# EAGLE design oresat-camera-board-v2 (EAGLE 9.3.2)
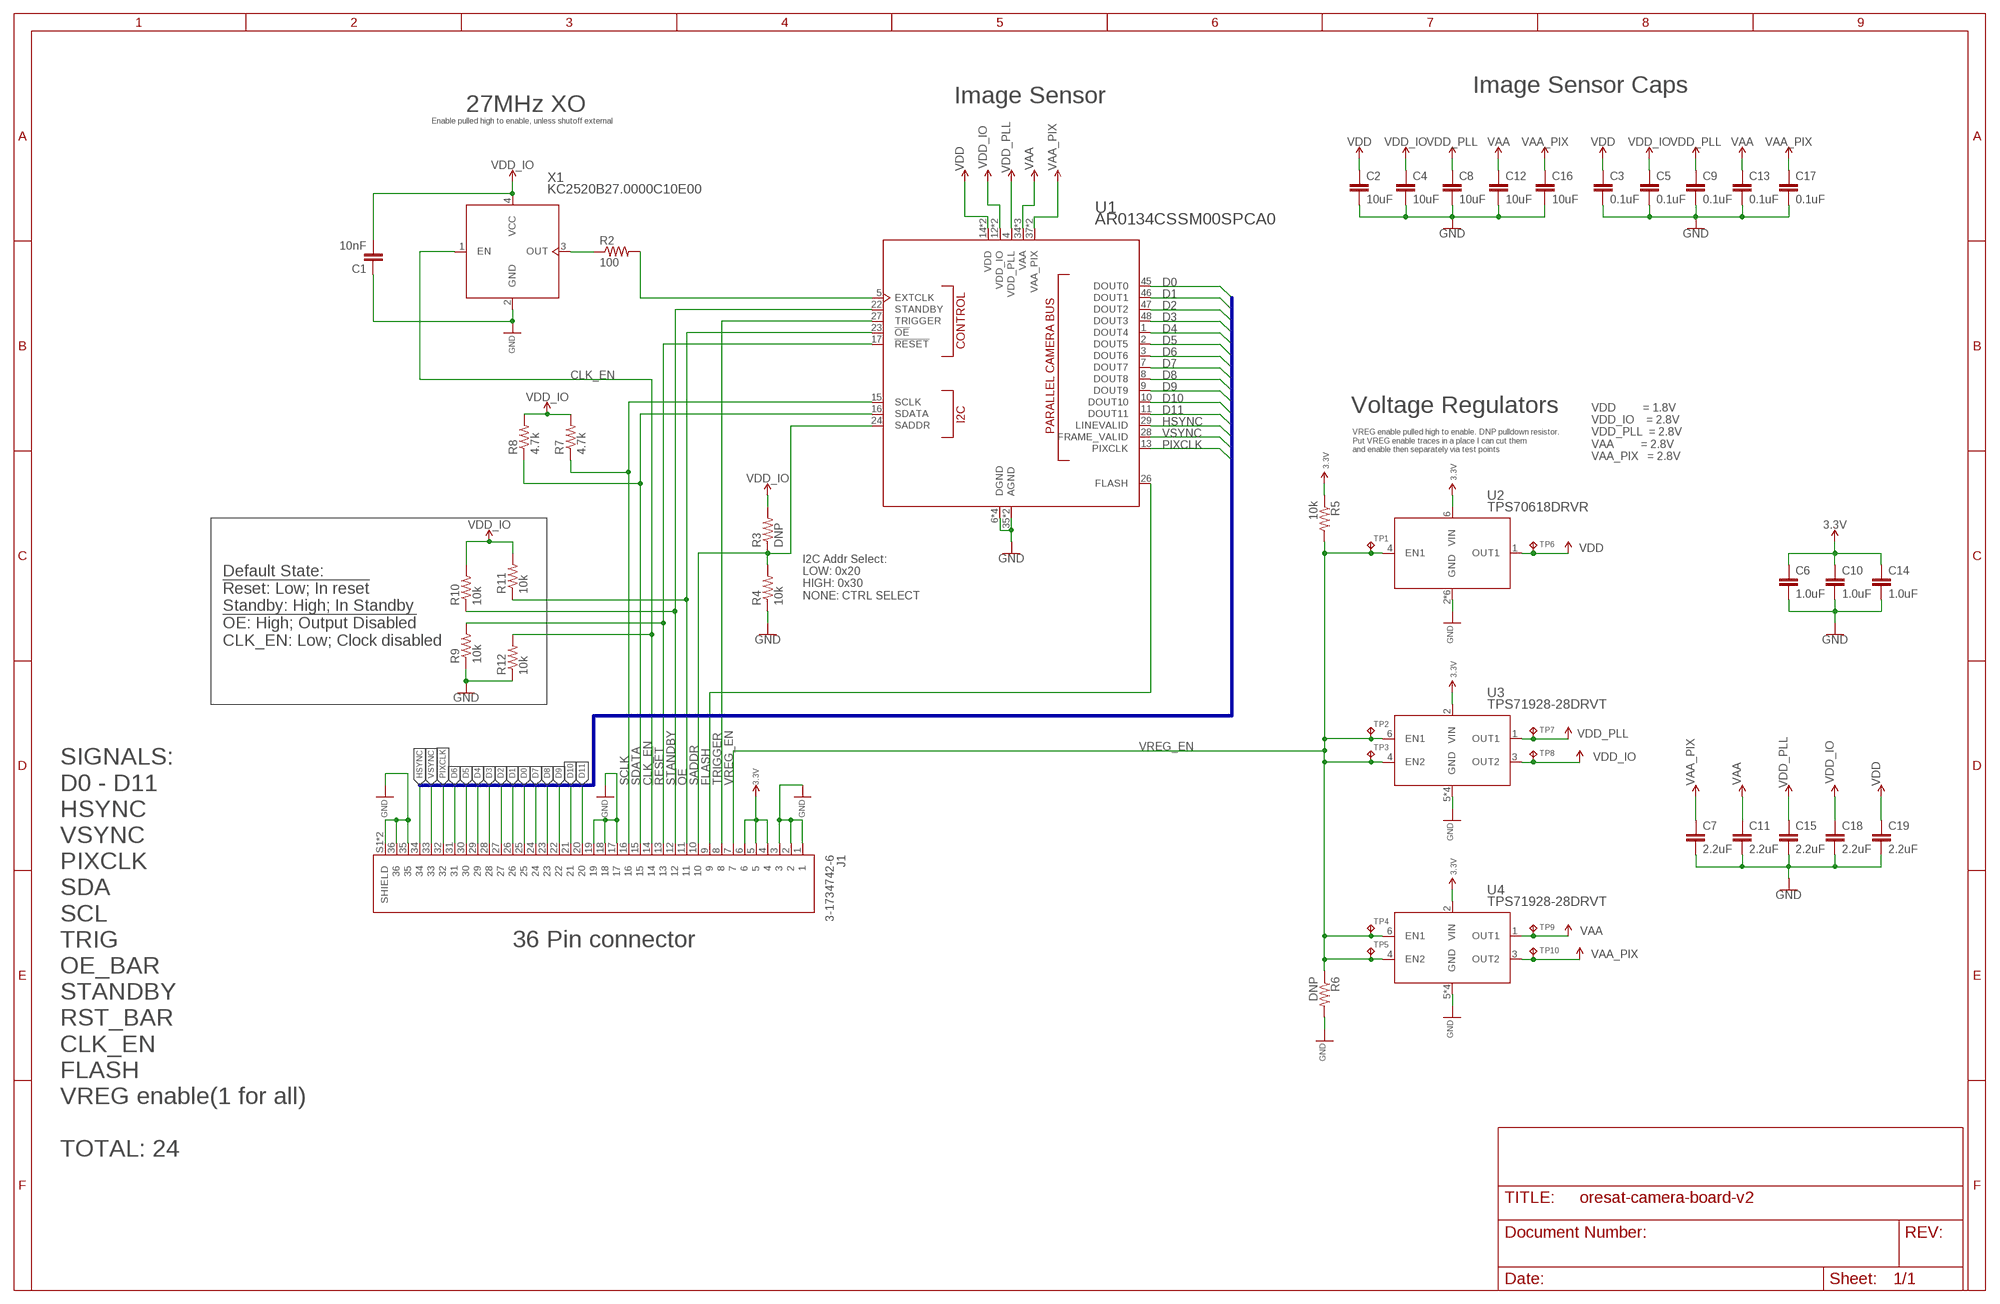
[diagram p0: schematic, sheet 1]

## Parts
C1  10nF  C-EU0402-A-NOSILK  [.0402-A-NOSILK]
C2  10uF  C-EU0603-C-NOSILK  [.0603-C-NOSILK]
C3  0.1uF  C-EU0402-B-NOSILK  [.0402-B-NOSILK]
C4  10uF  C-EU0603-C-NOSILK  [.0603-C-NOSILK]
C5  0.1uF  C-EU0402-B-NOSILK  [.0402-B-NOSILK]
C6  1.0uF  C-EU0603-C-NOSILK  [.0603-C-NOSILK]
C7  2.2uF  C-EU0603-C-NOSILK  [.0603-C-NOSILK]
C8  10uF  C-EU0603-C-NOSILK  [.0603-C-NOSILK]
C9  0.1uF  C-EU0402-B-NOSILK  [.0402-B-NOSILK]
C10  1.0uF  C-EU0603-C-NOSILK  [.0603-C-NOSILK]
C11  2.2uF  C-EU0603-C-NOSILK  [.0603-C-NOSILK]
C12  10uF  C-EU0603-C-NOSILK  [.0603-C-NOSILK]
C13  0.1uF  C-EU0402-B-NOSILK  [.0402-B-NOSILK]
C14  1.0uF  C-EU0603-C-NOSILK  [.0603-C-NOSILK]
C15  2.2uF  C-EU0603-C-NOSILK  [.0603-C-NOSILK]
C16  10uF  C-EU0603-C-NOSILK  [.0603-C-NOSILK]
C17  0.1uF  C-EU0402-B-NOSILK  [.0402-B-NOSILK]
C18  2.2uF  C-EU0603-C-NOSILK  [.0603-C-NOSILK]
C19  2.2uF  C-EU0603-C-NOSILK  [.0603-C-NOSILK]
J1  3-1734742-6  [TE_3-1734742-6]
R2  100  R-US_0402-B  [.0402-B]
R3  DNP  R-US_0402-B-NOSILK  [.0402-B-NOSILK]
R4  10k  R-US_0402-B-NOSILK  [.0402-B-NOSILK]
R5  10k  R-US_0402-B-NOSILK  [.0402-B-NOSILK]
R6  DNP  R-US_0402-B-NOSILK  [.0402-B-NOSILK]
R7  4.7k  R-US_0402-B-NOSILK  [.0402-B-NOSILK]
R8  4.7k  R-US_0402-B-NOSILK  [.0402-B-NOSILK]
R9  10k  R-US_0402-B  [.0402-B]
R10  10k  R-US_0402-B  [.0402-B]
R11  10k  R-US_0402-B  [.0402-B]
R12  10k  R-US_0402-B  [.0402-B]
TP1  TPTP06R  [TP06R]
TP2  TPTP06R  [TP06R]
TP3  TPTP06R  [TP06R]
TP4  TPTP06R  [TP06R]
TP5  TPTP06R  [TP06R]
TP6  TPTP06R  [TP06R]
TP7  TPTP06R  [TP06R]
TP8  TPTP06R  [TP06R]
TP9  TPTP06R  [TP06R]
TP10  TPTP06R  [TP06R]
U1  AR0134CSSM00SPCA0  [AR0134CSSM00SPCA0]
U2  TPS70618DRVR  [DRV6_1P6X1]
U3  TPS71928-28DRVT  [DRV6_1P6X1]
U4  TPS71928-28DRVT  [DRV6_1P6X1]
X1  KC2520B27.0000C10E00  [OSC_KYOCERA_KC2520B]

## Nets
3.3V: C6.1 C10.1 C14.1 J1.4 J1.5 J1.6 R5.1 U2.6(VIN) U3.2(VIN) U4.2(VIN)
!OE: J1.11 R11.1 U1.23(!OE)
!RESET: J1.13 R9.2 U1.17(!RESET)
CLK_EN: J1.14 R12.2 X1.1(EN)
D0: J1.25 U1.45(DOUT0)
D1: J1.26 U1.46(DOUT1)
D2: J1.27 U1.47(DOUT2)
D3: J1.28 U1.48(DOUT3)
D4: J1.29 U1.1(DOUT4)
D5: J1.30 U1.2(DOUT5)
D6: J1.31 U1.3(DOUT6)
D7: J1.24 U1.7(DOUT7)
D8: J1.23 U1.8(DOUT8)
D9: J1.22 U1.9(DOUT9)
D10: J1.21 U1.10(DOUT10)
D11: J1.20 U1.11(DOUT11)
FLASH: J1.9 U1.26(FLASH)
GND: C1.1 C2.2 C3.2 C4.2 C5.2 C6.2 C7.2 C8.2 C9.2 C10.2 C11.2 C12.2 C13.2 C14.2 C15.2 C16.2 C17.2 C18.2 C19.2 J1.1 J1.2 J1.3 J1.17 J1.18 J1.19 J1.35 J1.36 J1.S1(SHIELD) J1.S2(SHIELD) R4.1 R6.2 R9.1 R12.1 U1.6(DGND) U1.25(DGND) U1.30(DGND) U1.35(AGND) U1.39(AGND) U1.44(DGND) U2.2(GND) U2.3(GND) U2.5(GND) U2.7(GND) U2.8(GND) U2.9(GND) U3.5(GND) U3.7(GND) U3.8(GND) U3.9(GND) U4.5(GND) U4.7(GND) U4.8(GND) U4.9(GND) X1.2(GND)
HSYNC: J1.34 U1.29(LINEVALID)
N$1: R2.1 X1.3(OUT)
N$2: R2.2 U1.5(EXTCLK)
PIXCLK: J1.32 U1.13(PIXCLK)
SADDR: J1.10 R3.1 R4.2 U1.24(SADDR)
SCLK: J1.16 R7.1 U1.15(SCLK)
SDATA: J1.15 R8.1 U1.16(SDATA)
STANDBY: J1.12 R10.1 U1.22(STANDBY)
TRIGGER: J1.8 U1.27(TRIGGER)
VAA: C11.1 C12.1 C13.1 TP9.TP U1.34(VAA) U1.36(VAA) U1.40(VAA) U4.1(OUT1)
VAA_PIX: C7.1 C16.1 C17.1 TP10.TP U1.37(VAA_PIX) U1.38(VAA_PIX) U4.3(OUT2)
VDD: C2.1 C3.1 C19.1 TP6.TP U1.14(VDD) U1.19(VDD) U2.1(OUT1)
VDD_IO: C1.2 C4.1 C5.1 C18.1 R3.2 R7.2 R8.2 R10.2 R11.2 TP8.TP U1.12(VDD_IO) U1.18(VDD_IO) U3.3(OUT2) X1.4(VCC)
VDD_PLL: C8.1 C9.1 C15.1 TP7.TP U1.4(VDD_PLL) U3.1(OUT1)
VREG_EN: J1.7 R5.2 R6.1 TP1.TP TP2.TP TP3.TP TP4.TP TP5.TP U2.4(EN1) U3.4(EN2) U3.6(EN1) U4.4(EN2) U4.6(EN1)
VSYNC: J1.33 U1.28(FRAME_VALID)

## Buses
D[0..11],HSYNC,PIXCLK,VSYNC

## Notes on the sheet
- Image Sensor Caps
- Image Sensor
- 27MHz XO
- Enable pulled high to enable, unless shutoff external
- Voltage Regulators
- VREG enable pulled high to enable. DNP pulldown resistor. 
  Put VREG enable traces in a place I can cut them
  and enable then separately via test points
- VDD         = 1.8V
  VDD_IO    = 2.8V
  VDD_PLL  = 2.8V
  VAA         = 2.8V
  VAA_PIX   = 2.8V
- I2C Addr Select:
  LOW: 0x20
  HIGH: 0x30 
  NONE: CTRL SELECT
- Default State:
  !Reset: Low; In reset
  Standby: High; In Standby
  !OE: High; Output Disabled
  CLK_EN: Low; Clock disabled
- 36 Pin connector
- SIGNALS:
  D0 - D11
  HSYNC
  VSYNC
  PIXCLK
  SDA
  SCL
  TRIG
  OE_BAR
  STANDBY
  RST_BAR
  CLK_EN
  FLASH
  VREG enable(1 for all)
  
  TOTAL: 24

## Library data of the parts
C1-C19 = oresat-rcl:C-EU: CAPACITOR, European symbol
J1 = J-TEConnectivity-3-1734742-6 :3-1734742-6: 36 Position FFC, FPC Connector Contacts, Vertical, 1 Sided 0.020" (0.50mm) Surface Mount; COMMENT: 4-1734742-0; DESCRIPTION: Conn FPC Connector SKT 36 POS 0.5mm Solder ST SMD T/R; DIGI-KEY_PART_NUMBER: A100242CT-ND; MF: TE Connectivity; MP: 4-1734742-0; PACKAGE: None
R2-R12 = oresat-rcl:R-US_: RESISTOR, American symbol
TP1-TP10 = J-TestPoint-Small:TP: Test pad
U1 = U-ONSemi-AR0134:AR0134CSSM00SPCA0
U2 = U-TI-TPS70618-VoltageReg:TPS70618DRVR; MANUFACTURER_PART_NUMBER: TPS7192828DRVT; VENDOR: Texas Instruments
U3 U4 = U-TI-TPS71928-28-VoltageReg:TPS71928-28DRVT; MANUFACTURER_PART_NUMBER: TPS7192828DRVT; VENDOR: Texas Instruments
X1 = X-KYOCERA-KC2520B27:KC2520B27.0000C10E00; MANUFACTURER_PART_NUMBER: KC2520B27.0000C10E00; VENDOR: Kyocera

## Board
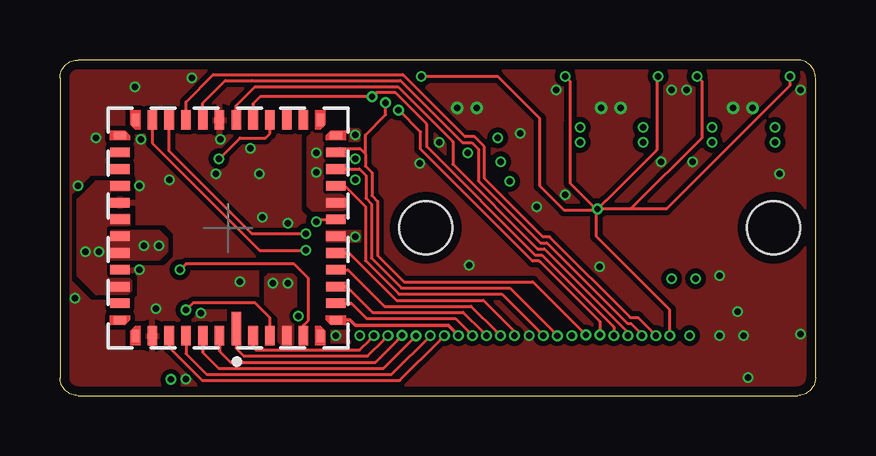
[diagram p1: board, top side]
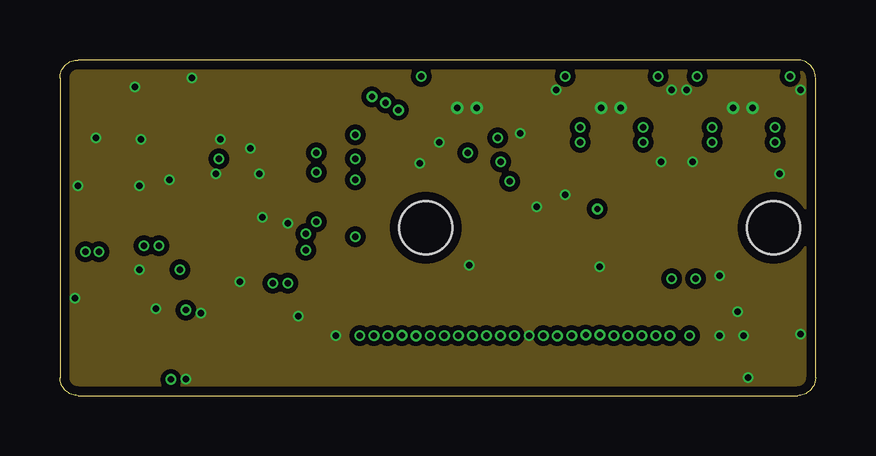
[diagram p2: board, inner layer Route2]
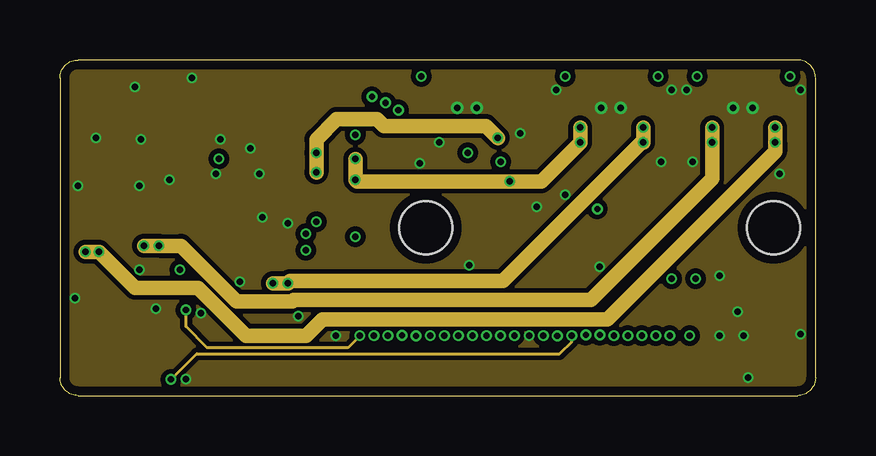
[diagram p3: board, inner layer Route15]
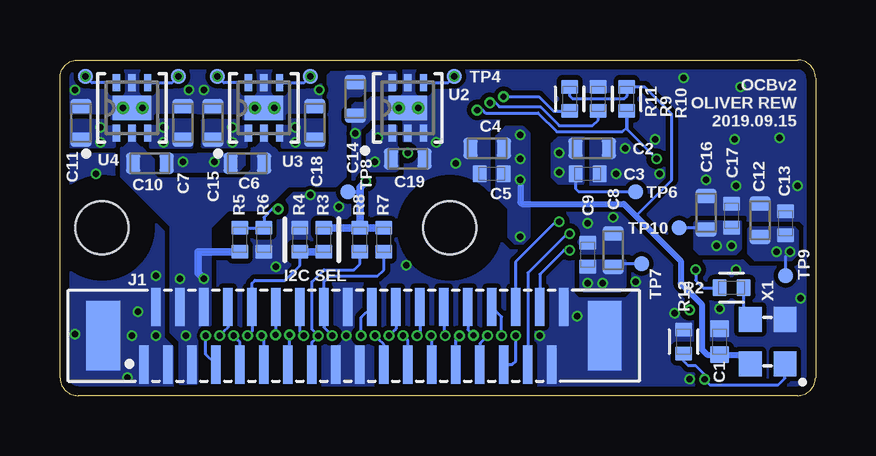
[diagram p4: board, bottom side, seen from below]

Size 31.5 x 14 mm. Coordinates in mm from the lower left corner, seen from the top.
Outline: 0.75,0 30.75,0 arc90 31.5,0.75 31.5,13.25 arc90 30.75,14 0.75,14 arc90 0,13.25 0,0.75 arc90 0.75,0
Copper layers (1*2*15*16): Top 0.035559375mm / dielectric 0.17018125mm / Route2 0.01778125mm / dielectric 47mil / Route15 0.01778125mm / dielectric 0.17018125mm / Bottom 0.035559375mm
Design rules "oshpark-4layer-tented": minimum track width 5mil, minimum drill 10mil, track to track 5mil, track to pad 5mil, pad to pad 5mil, via to via 5mil, smd to smd 5mil, copper to edge 15mil, drill to drill 6mil, minimum pad ring 4mil, minimum via ring 4mil, stop-mask expansion 2.5mil, vias tented up to drill 20mil, thermal gap 10mil
Holes 2.2 mm at 15.25,7 29.75,7
bRestrict: area 13.8,5.5 to 16.8,8.5; area 28.2,5.5 to 31.2,8.5

### Footprints (pad centres in the part's own frame; a part is rotated, then mirrored left to right if it is on the bottom)
.0402-A-NOSILK = smd 0.7 x 0.8: 1 -0.55,0; 2 0.55,0
.0603-C-NOSILK = smd 0.6 x 0.9: 1 -0.7,0; 2 0.7,0
.0402-B-NOSILK = smd 0.6 x 0.7: 1 -0.5,0; 2 0.5,0
TE_3-1734742-6 = smd 0.4 x 1.6: 1 -9.75,-1.2; 2 -9.25,1.2; 3 -8.75,-1.2; 4 -8.25,1.2; 5 -7.75,-1.2; 6 -7.25,1.2; 7 -6.75,-1.2; 8 -6.25,1.2; 9 -5.75,-1.2; 10 -5.25,1.2; 11 -4.75,-1.2; 12 -4.25,1.2; 13 -3.75,-1.2; 14 -3.25,1.2; 15 -2.75,-1.2; 16 -2.25,1.2; 17 -1.75,-1.2; 18 -1.25,1.2; 19 -0.75,-1.2; 20 -0.25,1.2; 21 0.25,-1.2; 22 0.75,1.2; 23 1.25,-1.2; 24 1.75,1.2; 25 2.25,-1.2; 26 2.75,1.2; 27 3.25,-1.2; 28 3.75,1.2; 29 4.25,-1.2; 30 4.75,1.2; 31 5.25,-1.2; 32 5.75,1.2; 33 6.25,-1.2; 34 6.75,1.2; 35 7.25,-1.2; 36 7.75,1.2 | smd 1.4 x 2.9: S1 -11.45,0; S2 9.45,0
.0402-B = smd 0.6 x 0.7: 1 -0.5,0; 2 0.5,0
TP06R = smd 0.6 x 0.6: TP 0,0
AR0134CSSM00SPCA0 = smd 0.4 x 1.4: 1 -0.35,4.2 | smd 0.4 x 0.8: 2 -1.05,4.5; 3 -1.75,4.5; 4 -2.45,4.5; 5 -3.15,4.5; 20 -3.15,-4.5; 21 -2.45,-4.5; 22 -1.75,-4.5; 23 -1.05,-4.5; 24 -0.35,-4.5; 25 0.35,-4.5; 26 1.05,-4.5; 27 1.75,-4.5; 28 2.45,-4.5; 29 3.15,-4.5; 44 3.15,4.5; 45 2.45,4.5; 46 1.75,4.5; 47 1.05,4.5; 48 0.35,4.5 | smd 0.3 x 0.5: 6 -3.85,4.5; 19 -3.85,-4.5; 30 3.85,-4.5; 43 3.85,4.5 | smd 0.5 x 0.3: 7 -4.5,3.85; 18 -4.5,-3.85; 31 4.5,-3.85; 42 4.5,3.85 | smd 0.8 x 0.4: 8 -4.5,3.15; 9 -4.5,2.45; 10 -4.5,1.75; 11 -4.5,1.05; 12 -4.5,0.35; 13 -4.5,-0.35; 14 -4.5,-1.05; 15 -4.5,-1.75; 16 -4.5,-2.45; 17 -4.5,-3.15; 32 4.5,-3.15; 33 4.5,-2.45; 34 4.5,-1.75; 35 4.5,-1.05; 36 4.5,-0.35; 37 4.5,0.35; 38 4.5,1.05; 39 4.5,1.75; 40 4.5,2.45; 41 4.5,3.15
DRV6_1P6X1 = smd 0.7 x 0.3: 1 -1.05,0.65; 2 -1.05,0; 3 -1.05,-0.65; 4 1.05,-0.65; 5 1.05,0; 6 1.05,0.65 | smd 1.016 x 1.6: 7 0,0 | drill 0.254 pad 0.508: 8 0,0.375; 9 0,-0.438
OSC_KYOCERA_KC2520B = smd 1.05 x 0.95: 1 -0.925,-0.725; 2 0.925,-0.725; 3 0.925,0.725; 4 -0.925,0.725

### Placement (x,y rotation side)
C1  4,2.25 270 bottom
C2  9.31,10.31 0 bottom
C3  9.5,9.25 0 bottom
C4  13.69,10.31 180 bottom
C5  13.5,9.25 180 bottom
C6  23.69,9.69 180 bottom
C7  26.38,11.38 90 bottom
C8  8.44,6.06 90 bottom
C9  9.5,5.88 90 bottom
C10  27.75,9.69 0 bottom
C11  30.62,11.38 90 bottom
C12  2.31,7.31 90 bottom
C13  1.25,7.19 90 bottom
C14  19.19,12.38 270 bottom
C15  25.12,11.38 90 bottom
C16  4.56,7.62 90 bottom
C17  3.5,7.5 90 bottom
C18  20.88,11.38 90 bottom
C19  17,9.88 0 bottom
J1  18.25,2.5 0 bottom
R2  3.5,4.5 180 bottom
R3  20.5,6.5 90 bottom
R4  21.5,6.5 270 bottom
R5  24,6.5 90 bottom
R6  23,6.5 270 bottom
R7  18,6.5 90 bottom
R8  19,6.5 90 bottom
R9  9.06,12.38 270 bottom
R10  7.88,12.38 90 bottom
R11  10.25,12.38 90 bottom
R12  5.5,2.25 270 bottom
TP1  30.44,13.31 0 bottom
TP2  24.94,13.31 0 bottom
TP3  26.56,13.31 0 bottom
TP4  15.06,13.31 0 bottom
TP5  21.06,13.31 0 bottom
TP6  7.5,8.5 0 bottom
TP7  7.25,5.5 0 bottom
TP8  19.5,8.5 0 bottom
TP9  1.25,5 0 bottom
TP10  5.69,7 0 bottom
U1  7,7 180 top
U2  17,12 90 bottom
U3  23,12 90 bottom
U4  28.5,12 90 bottom
X1  2,2.25 90 bottom

### Tracks (layer width: path | path; a pad name or v marks a point on that pad's centre or on a via)
3.3V  (via drill 0.25)
  Bottom 0.305: R5.1 25.75,6 25.75,5.12 v25.5,4.88
  other vias: 26.25,2.5 26.5,4.88
  pour Bottom (rank 2, no thermals): 28.94,10.31 28.94,9.31 28.06,9.31 28.06,10.31 28.12,10.31 28.38,10.56 28.38,11.25 28.62,11.25 28.62,10.56 28.88,10.31
  pour Bottom (rank 2, no thermals): 23.44,10.31 23.44,9.31 22.56,9.31 22.56,10.31 22.62,10.31 22.88,10.56 22.88,11.25 23.12,11.25 23.12,10.56 23.38,10.31
  pour Bottom (no thermals): 25.25,4.5 25.25,2.94 25.62,2.94 25.75,2.81 25.81,2.75 25.81,2.06 25.81,0.5 26.5,0.5 26.5,2.25 26.75,2.5 26.88,2.62 26.88,3.44 26.88,5.25 26.5,5.25 25.25,5.25
  pour Bottom (rank 3, no thermals): 26.88,5.25 26.88,7.06 28.94,9.12 28.94,10.31 28.06,10.31 27.62,9.88 27.62,9.25 27.44,9.06 23.88,9.06 23.5,9.44 23.5,10.31 22.56,10.31 22.44,10.19 20.44,10.19 20.31,10.31 20.31,13.38 20.19,13.5 18.81,13.5 18.69,13.38 18.69,12.81 19,12.5 19.44,12.5 19.62,12.31 19.62,9.12 20,8.75 22,8.75 23,7.75 24.5,7.75 25.25,7 25.25,5.25
  pour Bottom (no thermals): 17.69,12.75 19.62,12.75 19.69,12.81 19.69,13.38 19.56,13.5 17.56,13.5 17.5,13.44 17.5,12.81 17.56,12.75
!OE  (via drill 0.25)
  Top 0.127: v23.09,2.5 23.09,2.86 20.09,5.86 19.81,5.86 15.29,10.38 15.29,11.32 13.98,12.63 13.17,12.63 v13.01,12.46 8.34,12.46 8.05,12.18 U1.23
  Bottom 0.127: J1.11 23,2.41 v23.09,2.5 | v13.01,12.46 11.53,12.46 10.94,11.88 R11.1
!RESET  (via drill 0.25)
  Top 0.127: U1.17 11.66,10.31 12.5,10.31 12.73,10.08 | 12.73,10.08 12.73,9.56 13,9.29 13,8.34 13.24,8.1 13.24,5.84 14.34,4.74 19.71,4.74 21.75,2.7 21.75,2.69 v21.92,2.53 | 12.73,10.08 12.73,10.87 13.58,11.72 v13.58,12.21
  Bottom 0.127: J1.13 21.92,1.38 v21.92,2.53 | v13.58,12.21 13.35,12.21 13.18,12.04 11.47,12.04 10.68,11.26 9.3,11.26 9.06,11.5 R9.2
CLK_EN  (via drill 0.25)
  Route15 0.127: v4.62,0.67 5.7,1.75 20.83,1.75 21.34,2.25 v21.34,2.5
  Bottom 0.127: X1.1 1.27,0.72 1.56,0.45 4.4,0.45 v4.62,0.67 4.62,0.88 5,1.25 5.31,1.25 5.5,1.44 R12.2 | v21.34,2.5 21.5,2.67 J1.14
D0  (via drill 0.25)
  Top 0.127: U1.45 4.55,2.01 5.93,0.63 14.16,0.63 15.86,2.33 v16.02,2.5
  Bottom 0.127: J1.25 16,2.48 v16.02,2.5
D1  (via drill 0.25)
  Top 0.127: U1.46 5.25,1.75 6.12,0.88 13.82,0.88 v15.44,2.5
  Bottom 0.127: J1.26 15.5,2.56 v15.44,2.5
D2  (via drill 0.25)
  Top 0.127: U1.47 5.95,1.8 6.61,1.14 13.48,1.14 v14.84,2.5
  Bottom 0.127: J1.27 15,2.34 v14.84,2.5
D3  (via drill 0.25)
  Top 0.127: U1.48 6.65,1.85 7.11,1.39 13.15,1.39 14.09,2.33 14.09,2.34 v14.26,2.51
  Bottom 0.127: J1.28 14.5,2.75 v14.26,2.51
D4  (via drill 0.25)
  Top 0.127: U1.1 7.35,1.96 7.67,1.65 12.82,1.65 13.5,2.33 v13.67,2.5
  Bottom 0.127: v13.67,2.5 14,2.17 J1.29
D5  (via drill 0.25)
  Top 0.127: U1.2 8.05,2.01 8.16,1.9 12.49,1.9 12.92,2.33 v13.08,2.5
  Bottom 0.127: v13.08,2.5 13.08,3.28 J1.30
D6  (via drill 0.25)
  Top 0.127: U1.3 8.75,3.25 8.12,3.88 5.56,3.88 v5.25,3.57
  Route15 0.127: v12.5,2.5 12,2 6.13,2 5.25,2.88 v5.25,3.57
  Bottom 0.127: J1.31 12.64,1.3 12.5,1.44 v12.5,2.5
D7  (via drill 0.25)
  Top 0.152: U1.7 12.1,3.15 12.32,2.93 14.07,2.93 14.08,2.94 16.2,2.94 16.45,2.68 16.45,2.65 v16.61,2.5
  Bottom 0.127: J1.24 16.5,2.61 v16.61,2.5
D8  (via drill 0.25)
  Top 0.127: U1.8 12.15,3.85 12.78,3.22 16.48,3.22 17.02,2.67 v17.19,2.5
  Bottom 0.127: J1.23 17,2.3 17.02,2.33 v17.19,2.5
D9  (via drill 0.25)
  Top 0.127: U1.9 11.95,4.55 13.03,3.47 16.81,3.47 17.61,2.67 v17.77,2.5
  Bottom 0.127: J1.22 17.5,2.78 17.61,2.67 v17.77,2.5
D10  (via drill 0.25)
  Top 0.127: U1.10 12,5.25 13.53,3.72 17.14,3.72 18.19,2.67 v18.36,2.5
  Bottom 0.127: J1.21 18,2.13 18.19,2.33 v18.36,2.5
D11  (via drill 0.25)
  Top 0.127: U1.11 12.05,5.95 14.02,3.98 17.65,3.98 18.94,2.68 v18.94,2.5
  Bottom 0.127: v18.94,2.5 18.94,3.26 J1.20
FLASH  (via drill 0.25)
  Top 0.127: U1.26 5.95,12.2 6.89,13.14 8,13.14 14.19,13.14 16.78,10.54 17.17,10.54 17.44,10.28 17.44,8.95 20.02,6.37 20.3,6.37 23.67,3 23.81,3 24.26,2.56 v24.26,2.5
  Bottom 0.127: J1.9 24,2.24 24.09,2.33 v24.26,2.5
GND  (via drill 0.25)
  other vias: 3.38,10.69 11.5,2.5 4,3.62 3.31,5.25 1.5,10.75 3.31,8.75 6.69,10.69 4.56,9 8.44,7.44 9.5,7.19 8.31,9.25 7.94,10.31 0.75,8.75 15.81,10.56 19.19,10.94 20.69,12.75 25.5,12.75 26.12,12.75 30.88,12.75 26.38,9.75 25.06,9.75 0.62,4.06 19.56,2.5 15,9.69 19.88,7.88 21.06,8.38 27.5,2.5 28.25,3.5 27.5,5 28.5,2.5 30.88,2.56 28.69,0.75 22.5,5.38 7.5,4.75 9.94,3.31 17.06,5.44 6.5,9.25 5.5,13.25 3.12,12.88 30,9.25 5.88,3.44 5.25,0.69
  pour Top (isolate 0.2, rank 3): -0.25,-0.25 31.75,-0.25 31.75,14.25 -0.25,14.25
  pour Route2 (isolate 0.2): -1,-1 32.5,-1 32.5,15 -1,15
  pour Route15 (isolate 0.2, rank 3): -0.75,-0.75 32.25,-0.75 32.25,14.75 -0.75,14.75
  pour Bottom (isolate 0.2, rank 4, no thermals): -0.5,-0.5 32,-0.5 32,14.5 -0.5,14.5
HSYNC  (via drill 0.25)
  Top 0.127: U1.29 3.85,10.54 8.33,6.06 v10.25,6.06
  Bottom 0.127: J1.34 11.5,5.06 10.5,6.06 v10.25,6.06
N$1
  Bottom 0.127: X1.3 3,3.45 R2.1
N$2  (via drill 0.25)
  Top 0.127: U1.5 10.15,2.93 10.36,3.14 10.36,4.89 9.75,5.5 5.25,5.5 v5,5.25
  Bottom 0.127: v5,5.25 5,4.81 4.69,4.5 R2.2
N$3  (via drill 0.25)
  other vias: 17,10.12
PIXCLK  (via drill 0.25)
  Top 0.127: v10.69,7.25 10.79,7.35 U1.13
  Bottom 0.127: J1.32 12.5,5.59 10.84,7.25 v10.69,7.25
SADDR  (via drill 0.25)
  Top 0.127: U1.24 7.35,12.1 8.13,12.88 14.09,12.88 16.38,10.59 16.38,9.66 19.92,6.12 20.2,6.12 23.67,2.64 v23.67,2.5
  Bottom 0.127: v23.67,2.5 23.51,2.67 23.5,2.68 J1.10 23.5,4.69 23.38,4.81 22.12,4.81 21.5,5.44 R4.2
  Bottom 0.305: R3.1 R4.2
SCLK  (via drill 0.25)
  Top 0.127: U1.15 11.88,8.75 12.73,7.89 12.73,5.63 14.13,4.23 18.42,4.23 19.98,2.67 v20.15,2.5
  Bottom 0.127: v20.15,2.5 20.5,2.85 J1.16 20.5,4.75 20.25,5 18.25,5 18,5.25 R7.1
SDATA  (via drill 0.25)
  Top 0.127: U1.16 12.49,9.45 12.75,9.19 12.75,8.23 12.99,8 12.99,5.73 14.23,4.49 18.75,4.49 20.57,2.67 20.57,2.66 v20.73,2.49
  Bottom 0.127: J1.15 21,2.22 v20.73,2.49 21,2.76 21,4.75 20.5,5.25 19.25,5.25 19,5.5 R8.1
STANDBY  (via drill 0.25)
  Top 0.127: v22.5,2.53 22.5,3.09 19.99,5.61 19.71,5.61 15.04,10.27 15.04,11 14.13,11.91 v14.11,11.91 | U1.22 8.75,10.94 8.56,10.75 7.5,10.75 v6.62,9.88
  Bottom 0.127: J1.12 v22.5,2.53 | v14.11,11.91 13.87,11.91 13.75,11.79 11.57,11.79 10.79,11.01 8.06,11.01 7.88,11.19 R10.1 7.88,11.12 v6.62,9.88
TRIGGER  (via drill 0.25)
  Top 0.127: U1.27 5.25,12.25 6.39,13.39 14.29,13.39 16.89,10.8 17.28,10.8 17.69,10.38 17.69,9.06 20.13,6.62 20.41,6.62 23.78,3.25 24.09,3.25 24.68,2.67 v24.84,2.5
  Bottom 0.127: J1.8 24.5,2.85 24.68,2.67 v24.84,2.5
VAA  (via drill 0.25)
  Route15 0.61: v1.06,6 v1.62,6 3.12,4.5 5.75,4.5 7.75,2.5 10.25,2.5 10.94,3.19 22.81,3.19 29.81,10.19 v29.81,10.56 v29.81,11.19
  Bottom 0.127: TP9.TP 1.25,5.81 v1.06,6
  pour Bottom (no thermals): 29.06,10.66 29.25,10.66 29.25,10.38 31.06,10.38 31.06,11.5 29.66,11.5 29.66,11.22 29.06,11.22
  pour Bottom (no thermals): 1.06,7 2.75,7 2.81,6.94 2.81,5.94 2.62,5.75 2.56,5.69 1.25,5.69 1,5.69 0.75,5.94 0.75,6.88 0.88,7
  pour Top (no thermals): 2.88,7.56 2.88,7.12 2,7.12 1.88,7 1.88,5.06 2.06,4.88 2.88,4.88 2.94,4.81 2.94,4.38 2.81,4.25 1.5,4.25 0.75,5 0.75,7.25 1.06,7.56
  pour Top (no thermals): 2.88,8.56 2.12,8.56 1.94,8.38 1.94,7.12 0.75,7.12 0.75,8.19 1.5,8.94 2.88,8.94
VAA_PIX  (via drill 0.25)
  Route15 0.61: v3.5,6.25 v4.12,6.25 5.04,6.25 7.36,3.94 9.7,3.94 9.75,3.99 22.13,3.99 27.19,9.04 v27.19,10.56 v27.19,11.19
  Bottom 0.127: C16.1 4.64,7 TP10.TP
  pour Bottom (no thermals): 27.94,10.66 27.75,10.66 27.75,10.38 26,10.38 26,11.5 27.34,11.5 27.34,11.22 27.94,11.22
  pour Bottom (no thermals): 3.56,7.25 5,7.25 5.06,7.19 5.06,6.12 4.94,6 4.88,5.94 3.5,5.94 3.31,5.94 3.19,6.06 3.12,6.12 3.12,7.06 3.12,7.25
  pour Top (rank 2, no thermals): 2.06,6.88 4.12,6.88 4.44,6.56 4.44,6 4.12,5.69 2.06,5.69
VDD  (via drill 0.25)
  Route15 0.61: v18.25,10.75 17.75,11.25 13.5,11.25 13.21,11.54 11.54,11.54 10.69,10.69 v10.69,10.12 v10.69,9.31
  Bottom 0.127: TP6.TP 9.88,8.5 10,8.62 C3.1
  other vias: 18.38,9.75
  pour Top (no thermals): 10.75,11.94 10.69,11.94 10.62,11.88 10.5,11.75 10.5,11.44 10.5,10.94 10.38,10.81 10.31,10.75 10.31,10.19 10.31,7.94 10.5,7.75 11.81,7.75 11.88,7.81 11.88,8.19 11.88,8.25 11.81,8.31 11.75,8.38 11.25,8.38 11.12,8.38 11,8.5 11,11 11.12,11.12 11.12,11.75 11.12,11.88 11.06,11.94
  pour Bottom (no thermals): 9.75,10.81 10.69,10.81 10.88,10.62 11,10.5 11,10.12 11,9.12 10.75,8.88 10.06,8.88 9.69,8.88 9.69,10.81
  pour Bottom (no thermals): 17.5,11 17.5,10.44 17.44,10.38 17.44,9.44 17.5,9.38 18.56,9.38 18.62,9.44 18.69,9.5 18.69,10.38 18.69,10.88 18.5,11.06 18.31,11.25 17.62,11.25 17.5,11.25
VDD_IO  (via drill 0.25)
  Route15 0.61: v12.31,9.88 v12.31,9 12.38,8.94 v18.75,8.94 20.06,8.94 v21.69,10.56 v21.69,11.19
  Bottom 0.127: 7.5,7.5 6,9 6,11.75 7.12,12.88 R10.2 7.88,12.5 8.01,12.37 10.12,12.37 10.25,12.49 R11.2
  Bottom 0.152: TP8.TP 19,8.5
  Bottom 0.254: v12.31,9 12.31,8.06 12.25,8 8,8 7.5,7.5 5.62,5.62 5.62,4.69 4.75,3.81 4.75,1.94 4.51,1.7 C1.2 3.1,1.7 X1.4
  Bottom 0.305: R7.2 R8.2 | R8.2 R3.2 | R8.2 19,8.5 19,8.69 v18.75,8.94
  other vias: 12.31,10.88 12.31,6.62
  pour Bottom (no thermals): 22.44,10.66 22.25,10.66 22.25,10.38 20.5,10.38 20.5,11.5 21.84,11.5 21.84,11.22 22.44,11.22
  pour Bottom (no thermals): 12.31,11.19 12.94,11.19 13.12,11 13.31,10.81 13.31,9.5 13.31,8.31 13.19,8.19 12.81,7.81 12.81,7 12.81,6.62 12.56,6.38 12.19,6.38 12.06,6.5 11.94,6.62 11.94,9.62 11.94,10.94 12.19,11.19
  pour Top (rank 2, no thermals): 11.19,10.88 11.44,11.12 12.44,11.12 12.56,11 12.56,10.75 12.44,10.62 11.19,10.62
  pour Top (no thermals): 11.12,6.88 12.5,6.88 12.56,6.81 12.56,6.56 12.56,6.5 12.5,6.44 11.12,6.44
VDD_PLL  (via drill 0.25)
  Route15 0.61: v8.88,4.69 v9.5,4.69 9.59,4.77 18.46,4.77 24.25,10.56 v24.31,10.56 v24.31,11.19
  Bottom 0.127: TP7.TP 8.3,5.5 C8.1
  pour Bottom (no thermals): 23.56,10.66 23.75,10.66 23.75,10.38 25.56,10.38 25.56,11.5 24.16,11.5 24.16,11.22 23.56,11.22
  pour Bottom (no thermals): 9.81,5.62 9.81,4.5 9.75,4.44 9.69,4.38 8.5,4.38 8.12,4.38 7.94,4.56 7.94,5.62
  pour Top (no thermals): 9.44,5.06 9.69,5.06 9.81,4.94 9.81,3.69 9.69,3.56 9.69,2.12 9.25,2.12 9.12,2.25 9.12,2.31 9.12,3.25 8.81,3.56 8.56,3.81 8.56,4.44 8.56,4.94 8.69,5.06
VREG_EN  (via drill 0.25)
  Top 0.127: 23.78,7.78 25.29,7.78 29.32,11.82 30.44,12.94 TP1.TP | v22.4,7.78 23.75,7.78 23.78,7.78 | v22.4,7.78 22.75,8.12 24.88,10.25 24.88,13.25 TP2.TP | v22.4,7.78 22.34,7.78 21.27,8.86 21.27,11.36 21.27,13.1 TP5.TP | 22.37,7.75 21,7.75 20,8.75 20,11.56 18.25,13.31 TP4.TP | 22.37,7.75 v22.4,7.78 | v25.42,2.5 25.42,3.58 22.37,6.63 22.37,7.75 | TP3.TP 26.75,13.12 26.75,10.75 23.78,7.78
  Bottom 0.127: U4.6 30.18,13.05 TP1.TP | U4.4 26.82,13.05 TP3.TP | U3.6 24.68,13.05 TP2.TP | U3.4 21.32,13.05 TP5.TP | U2.4 15.32,13.05 TP4.TP | v22.4,7.78 22.65,7.78 23,7.44 R6.1 R5.2 | J1.7 25.42,1.72 v25.42,2.5
  other vias: 30.44,13.31 26.56,13.31 24.94,13.31 21.06,13.31 15.06,13.31
VSYNC  (via drill 0.25)
  Top 0.127: v10.25,6.75 8,6.75 4.55,10.2 U1.28
  Bottom 0.127: v10.25,6.75 10.38,6.75 12,5.12 J1.33

### Text on the board
bPlace: OCBv2 / OLIVER REW / 2019.09.15 | I2C SEL
Document: Holes are 2.4mm for M2 through hole | OCBv2 == Oresat Camera Board v2 | M2 screws / 2.2mm through hole / 4mm head clearance / MC: 91292A004 | MAKE SURE FFC CONNECTOR IS / CORRECT ORIENTATION! CONTACTS / MUST BE ON TOP OF CONNECTOR TO / MATE WITH OCTAVO CARD. MEASURE / TWICE CUT ONCE!!!!